# EAGLE schematic 61000311 (EAGLE 5.11)
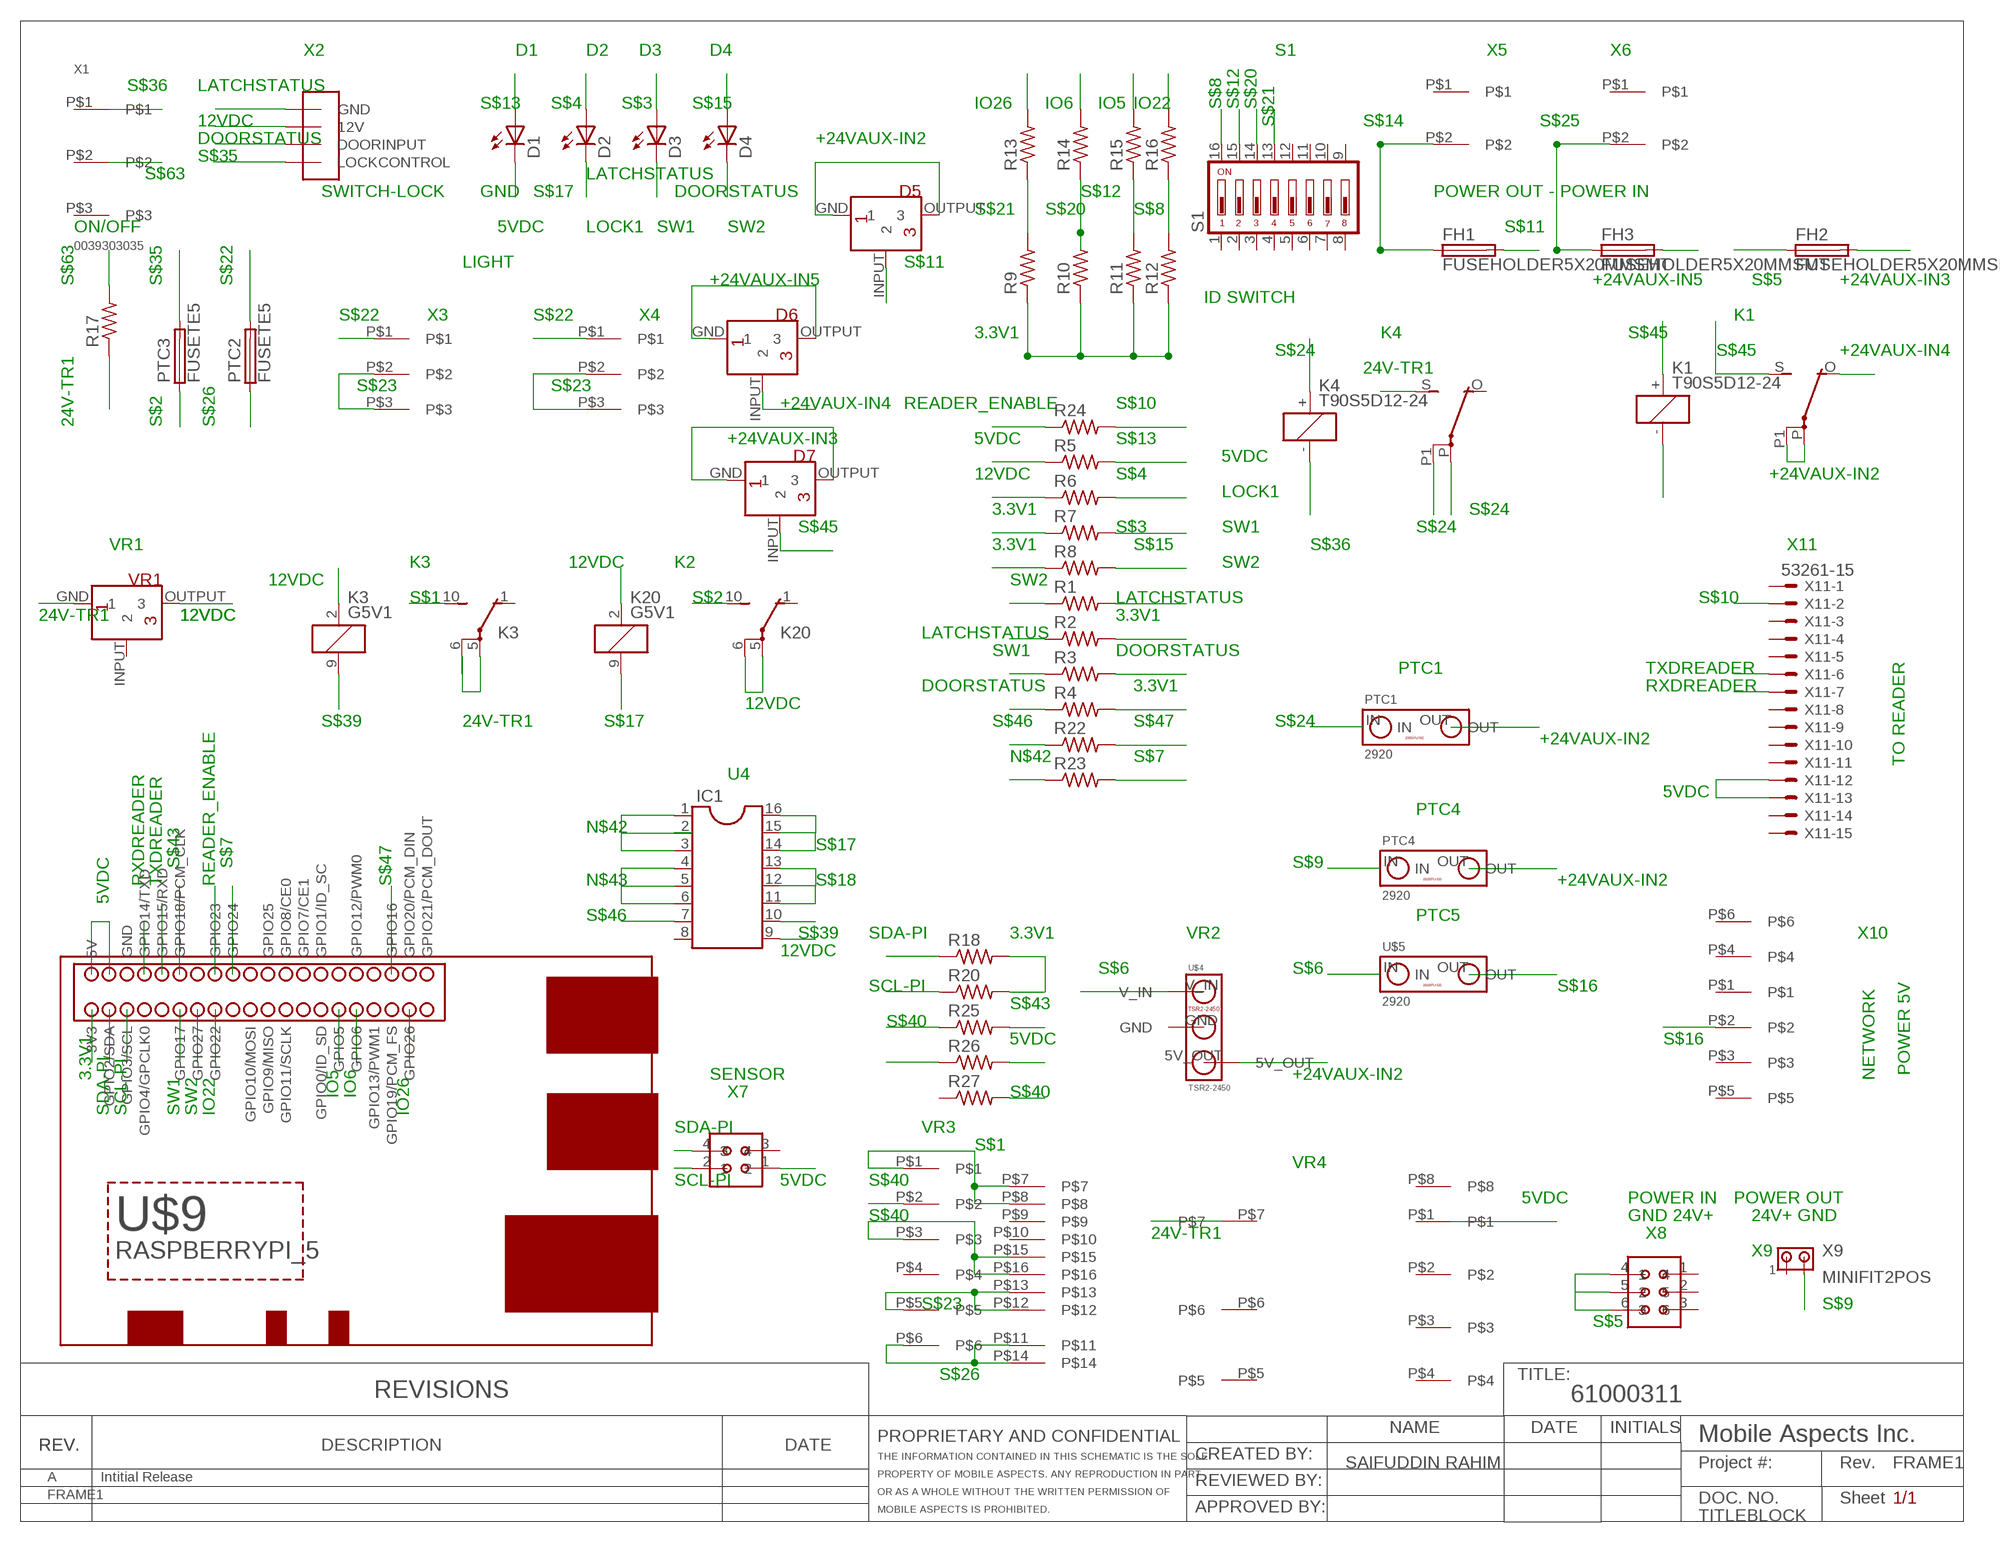
[diagram p0: schematic, sheet 1]

## Parts
D1  LED3MM  [LED3MM]
D2  LED3MM  [LED3MM]
D3  LED3MM  [LED3MM]
D4  LED3MM  [LED3MM]
D5  LF33ABDT-TR  [DPAK(TO-252)]
D6  LF33ABDT-TR  [DPAK(TO-252)]
D7  LF33ABDT-TR  [DPAK(TO-252)]
FH1  FUSEHOLDER5X20MMSMT  [FUSEHOLDERSMT]
FH2  FUSEHOLDER5X20MMSMT  [FUSEHOLDERSMT]
FH3  FUSEHOLDER5X20MMSMT  [FUSEHOLDERSMT]
IC1  DIL16  [DIL16]
K1  T90S5D12-24  [TO90]
K3  G5V1  [G5V1]
K4  T90S5D12-24  [TO90]
K20  G5V1  [G5V1]
MOLEX2  MOLEX-1040-NEW  [MOLEX-1040-NEW]
PTC1  2920  [2920]
PTC2  FUSETE5  [TE5]
PTC3  FUSETE5  [TE5]
PTC4  2920  [2920]
R1  R-US_R1206  [R1206]
R2  R-US_R1206  [R1206]
R3  R-US_R1206  [R1206]
R4  R-US_R1206  [R1206]
R5  R-US_R1206  [R1206]
R6  R-US_R1206  [R1206]
R7  R-US_R1206  [R1206]
R8  R-US_R1206  [R1206]
R9  R-US_R1206  [R1206]
R10  R-US_R1206  [R1206]
R11  R-US_R1206  [R1206]
R12  R-US_R1206  [R1206]
R13  R-US_R1206  [R1206]
R14  R-US_R1206  [R1206]
R15  R-US_R1206  [R1206]
R16  R-US_R1206  [R1206]
R17  R-US_R1206  [R1206]
R18  R-US_R1206  [R1206]
R20  R-US_R1206  [R1206]
R22  R-US_R1206  [R1206]
R23  R-US_R1206  [R1206]
R24  R-US_R1206  [R1206]
R25  R-US_R1206  [R1206]
R26  R-US_R1206  [R1206]
R27  R-US_R1206  [R1206]
S1  DA08  [DA-08]
U$4  TSR2-2450  [TSR2-2450]
U$5  2920  [2920]
U$6  945-1132-ND  [945-1132-ND]
U$9  RASPBERRYPI_5  [RASPBERRYPI_5]
U$13  LEDCON  [LEDCON]
U$14  KHHD10  [KHHD010]
VR1  LF33ABDT-TR  [DPAK(TO-252)]
X1  0039303035  [MINIFIT-3]
X2  MOLEX-CONNHEADER_6POS_MOTORCONTROL  [MOLEX-CONNHEADER_6POS_MOTORCONTROL]
X3  LEDCON  [LEDCON]
X4  LEDCON  [LEDCON]
X5  MWGAFIT  [MEGFIT]
X6  MWGAFIT  [MEGFIT]
X7  MOLEX-1040-NEW  [MOLEX-1040-NEW]
X9  MINIFIT2POS  [MINF2POS]
X11  53261-15  [53261-15]

## Nets
3.3V1: R2.2 R4.2 R7.1 R8.1 R9.1 R10.1 R11.1 R12.1 R18.2 R20.2 U$9.3V3
5VDC: R5.1 R26.2 U$9.5V X7.1 X11.12 X11.13
12VDC: IC1.9 K3.2 K20.2 K20.5(2:P) K20.6(2:P) VR1.OUTPUT X2.12V
24V-TR1: K3.5(2:P) K3.6(2:P) K4.S R17.1 VR1.GND
+24VAUX-IN2: D5.GND D5.OUTPUT K1.P K1.P1 PTC1.OUT PTC4.OUT
+24VAUX-IN3: D7.GND D7.OUTPUT FH2.2
+24VAUX-IN4: D6.INPUT K1.O
+24VAUX-IN5: D6.GND D6.OUTPUT FH3.2
D3: D3.K(C)
D4: D4.K(C)
DOORSTATUS: R3.2 R4.1 X2.DOORINPUT
GND: D1.K(C)
IO5: R15.2 U$9.GPIO5
IO6: R14.2 U$9.GPIO6
IO22: R16.2 U$9.GPIO22
IO26: R13.2 U$9.GPIO26
LATCHSTATUS: R1.2 R2.1 X2.GND
N$1: K1.-
N$2: R6.1
N$3: R8.2
N$42: IC1.1 IC1.2 IC1.3 R23.1
N$43: IC1.4 IC1.5 IC1.6
READER_ENABLE: R24.1 U$9.GPIO23
RXDREADER: U$9.GPIO13/TXD(GPIO14/TXD) X11.7
S$1: K3.10(2:S) U$6.P$1 U$6.P$7 U$6.P$8
S$2: K20.10(2:S) PTC3.1
S$3: D3.A R7.2
S$4: D2.A R6.2
S$5: FH2.1 MOLEX2.4 MOLEX2.5 MOLEX2.6
S$7: R23.2 U$9.GPIO24
S$8: R12.2 R16.1 S1.16
S$9: X9.P$2
S$10: R24.2 X11.2
S$11: D5.INPUT FH1.2
S$12: R11.2 R15.1 S1.15
S$13: D1.A R5.2
S$14: FH1.1 X5.P$2
S$15: D4.A
S$16: U$5.OUT U$13.P$2
S$17: D2.K(C) IC1.14 IC1.15 IC1.16 K20.9
S$18: IC1.11 IC1.12 IC1.13
S$20: R10.2 R14.1 S1.14
S$21: R9.2 R13.1 S1.13
S$22: PTC2.2 X3.P$1 X4.P$1
S$23: U$6.P$5 U$6.P$12 U$6.P$13 X3.P$2 X3.P$3 X4.P$2 X4.P$3
S$24: K4.+ K4.P K4.P1
S$25: FH3.1 X6.P$2
S$26: PTC2.1 U$6.P$6 U$6.P$11 U$6.P$14
S$35: PTC3.2 X2.LOCKCONTROL
S$36: K4.-
S$39: IC1.10 K3.9
S$40: R25.1 R26.1 R27.2 U$6.P$2 U$6.P$3 U$6.P$15 U$6.P$16
S$43: R25.2 U$9.GPIO18/PCM_CLK
S$45: D7.INPUT K1.+ K1.S
S$46: IC1.7 R22.1
S$47: R22.2 U$9.GPIO16
S$63: R17.2
SCL-PI: R20.1 U$9.GPIO3/SCL X7.2
SDA-PI: R18.1 U$9.GPIO2/SDA X7.4
SW1: R3.1 U$9.GPIO17
SW2: R1.1 U$9.GPIO27
TXDREADER: U$9.GPIO15/RXD X11.6
Unconnected: IC1.8 K3.1(2:O) K4.O K20.1(2:O) MOLEX2.1 MOLEX2.2 MOLEX2.3 PTC1.IN PTC4.IN R27.1 S1.1 S1.2 S1.3 S1.4 S1.5 S1.6 S1.7 S1.8 S1.9 S1.10 S1.11 S1.12 U$4.5V_OUT U$5.IN U$6.P$4 U$6.P$9 U$6.P$10 U$9.GND U$9.GPIO0/ID_SD U$9.GPIO1/ID_SC U$9.GPIO4/GPCLK0 U$9.GPIO7/CE1 U$9.GPIO8/CE0 U$9.GPIO9/MISO U$9.GPIO10/MOSI U$9.GPIO11/SCLK U$9.GPIO12/PWM0 U$9.GPIO13/PWM1 U$9.GPIO19/PCM_FS U$9.GPIO20/PCM_DIN U$9.GPIO21/PCM_DOUT U$9.GPIO25 U$13.P$1 U$13.P$3 U$13.P$4 U$13.P$5 U$13.P$6 U$14.P$1 U$14.P$2 U$14.P$3 U$14.P$4 U$14.P$5 U$14.P$6 U$14.P$7 U$14.P$8 VR1.INPUT X1.P$1 X1.P$2 X1.P$3 X5.P$1 X6.P$1 X7.3 X9.P$1 X11.1 X11.3 X11.4 X11.5 X11.8 X11.9 X11.10 X11.11 X11.14 X11.15

## Notes on the sheet
- X2 | D1 | D2 | D3 | D4 | S1 | X5 | X6
- S$36 | LATCHSTATUS
- S$13 | S$4 | S$3 | S$15 | IO26 | IO6 | IO5 | IO22 | S$8 | S$12 | S$20
- 12VDC | S$21 | S$14 | S$25
- DOORSTATUS | +24VAUX-IN2
- S$35
- S$63 | LATCHSTATUS
- SWITCH-LOCK | GND | S$17 | DOORSTATUS | S$12 | POWER OUT - POWER IN
- S$21 | S$20 | S$8
- ON/OFF | 5VDC | LOCK1 | SW1 | SW2 | S$11
- LIGHT | S$11
- S$63 | S$35 | S$22 | +24VAUX-IN5 | +24VAUX-IN5 | S$5 | +24VAUX-IN3
- ID SWITCH
- S$22 | X3 | S$22 | X4 | K1
- 3.3V1 | K4 | S$45
- S$24 | S$45 | +24VAUX-IN4
- 24V-TR1
- S$23 | S$23
- +24VAUX-IN4 | READER_ENABLE | S$10
- 24V-TR1 | S$2 | S$26
- +24VAUX-IN3 | 5VDC | S$13
- 5VDC
- 12VDC | S$4 | +24VAUX-IN2
- LOCK1
- 3.3V1 | S$24
- S$45 | S$3 | SW1 | S$24
- VR1 | 3.3V1 | S$15 | S$36 | X11
- K3 | 12VDC | K2 | SW2
- 12VDC | SW2
- S$1 | S$2 | LATCHSTATUS | S$10
- 24V-TR1 | 12VDC | 12VDC | 3.3V1
- LATCHSTATUS
- SW1 | DOORSTATUS | TO READER
- PTC1 | TXDREADER
- DOORSTATUS | 3.3V1 | RXDREADER
- 12VDC
- S$39 | 24V-TR1 | S$17 | S$46 | S$47 | S$24
- +24VAUX-IN2
- N$42 | S$7
- U4
- 5VDC
- PTC4
- N$42
- S$17
- S$43 | S$7 | S$9
- RXDREADER | TXDREADER | READER_ENABLE | S$47 | N$43 | S$18 | +24VAUX-IN2
- 5VDC
- S$46 | PTC5
- S$39 | SDA-PI | 3.3V1 | VR2 | X10
- 12VDC
- S$6 | S$6
- SCL-PI | S$16
- S$43
- S$40
- 5VDC | S$16
- 3.3V1 | SENSOR | +24VAUX-IN2 | NETWORK | POWER 5V
- IO5 | IO6 | X7 | S$40
- SDA-PI | SCL-PI | SW1 | SW2 | IO22 | IO26
- SDA-PI | VR3
- S$1
- VR4
- SCL-PI | 5VDC | S$40
- 5VDC | POWER IN | POWER OUT
- S$40 | GND 24V+ | 24V+ GND
- 24V-TR1 | X8
- X9
- S$23 | S$9
- S$5
- S$26
- SAIFUDDIN RAHIM

## Power pins joined to a net without a drawn wire
GND: U$4.GND
V_IN: U$4.V_IN

## Library data of the parts
D1-D4 = led:LED: LED OSRAM: - CHIPLED LG R971, LG N971, LY N971, LG Q971, LY Q971, LO R971, LY R971 LH N974, LH R974 LS Q976, LO Q976, LY Q976 LO Q996 - Hyper CHIPLED LW Q18S LB Q993, LB Q99A, LB R99A - SideLED LS A670, LO A670, LY A670, LG A670, LP A670 LB A673, LV A673, LT A673, LW A673 LH A674 LY A675 LS A676, LA A676, LO A676, LY A676, LW A676 LS A679, LY A679, LG A679 - Hyper Micro SIDELED® LS Y876, LA Y876, LO Y876, LY Y876 LT Y87S - SmartLED LW L88C, LW L88S LB L89C, LB L89S, LG L890 LS L89K, LO L89K, LY L89K LS L896, LA L896, LO L896, LY L896 - TOPLED LS T670, LO T670, LY T670, LG T670, LP T670 LSG T670, LSP T670, LSY T670, LOP T670, LYG T670 LG T671, LOG T671, LSG T671 LB T673, LV T673, LT T673, LW T673 LH T674 LS T676, LA T676, LO T676, LY T676, LB T676, LH T676, LSB T676, LW T676 LB T67C, LV T67C, LT T67C, LS T67K, LO T67K, LY T67K, LW E67C LS E67B, LA E67B, LO E67B, LY E67B, LB E67C, LV E67C, LT E67C LW T67C LS T679, LY T679, LG T679 LS T770, LO T770, LY T770, LG T770, LP T770 LB T773, LV T773, LT T773, LW T773 LH T774 LS E675, LA E675, LY E675, LS T675 LS T776, LA T776, LO T776, LY T776, LB T776 LHGB T686 LT T68C, LB T68C - Hyper Mini TOPLED® LB M676 - Mini TOPLED Santana® LG M470 LS M47K, LO M47K, LY M47K Source: http://www.osram.convergy.de LUXEON: - LUMILED® LXK2-PW12-R00, LXK2-PW12-S00, LXK2-PW14-U00, LXK2-PW14-V00 LXK2-PM12-R00, LXK2-PM12-S00, LXK2-PM14-U00 LXK2-PE12-Q00, LXK2-PE12-R00, LXK2-PE12-S00, LXK2-PE14-T00, LXK2-PE14-U00 LXK2-PB12-K00, LXK2-PB12-L00, LXK2-PB12-M00, LXK2-PB14-N00, LXK2-PB14-P00, LXK2-PB14-Q00 LXK2-PR12-L00, LXK2-PR12-M00, LXK2-PR14-Q00, LXK2-PR14-R00 LXK2-PD12-Q00, LXK2-PD12-R00, LXK2-PD12-S00 LXK2-PH12-R00, LXK2-PH12-S00 LXK2-PL12-P00, LXK2-PL12-Q00, LXK2-PL12-R00 Source: www.luxeon.com KINGBRIGHT: KA-3528ASYC Source: www.kingbright.com
D5-D7 VR1 = Mobile Aspects 083:LF33ABDT-TR
FH1-FH3 = Mobile Aspects 08:FUSEHOLDER5X20MMSMT
IC1 = ic-package:DIL16: Dual In Line / Socket
K1 K4 = Mobile Aspects 08:T90S5D12-24
K3 K20 = relay:G5V1: RELAY 1 x switch, 0.5 A/125 V AC, 1 A/24 V DC , Omron; MPN: G5V-1-DC24; OC_FARNELL: 9949593; OC_NEWARK: 36M6377
MOLEX2 = Mobile Aspects 09:MOLEX-1040-NEW
PTC1 PTC4 U$5 = Mobile_Aspects_Tester:2920
PTC2 PTC3 = fuse:FUSE: Fuse; OC_FARNELL: unknown; OC_NEWARK: unknown
R1-R18 R20 R22-R27 = rcl:R-US_: RESISTOR, American symbol
S1 = switch-dil:DA08: DIL/CODE SWITCH; MPN: MCDA08; OC_FARNELL: 9471561; OC_NEWARK: 26M1092
U$4 = Mobile_Aspects_Tester:TSR2-2450
U$6 = led_driver:945-1132-ND
U$9 = Mobile_Aspects_Tester:RASPBERRYPI_5
U$13 = LedCon2:LEDCON
U$14 = omnipower:KHHD10
X1 = Mobile Aspects 083:0039303035
X2 = Mobile_Aspects_Tester:MOLEX-CONNHEADER_6POS_MOTORCONTROL
X3 X4 = LedCon:LEDCON
X5 X6 = megafit:MWGAFIT
X7 = Mobile Aspects 091:MOLEX-1040-NEW
X9 = Mobile Aspects 08:MINIFIT2POS
X11 = con-molex:53?-15: CONNECTOR wire to board 1.25 mm (.049 inch) pitch header; OC_FARNELL: 1125365; OC_NEWARK: unknown